# EAGLE schematic MCU (EAGLE 9.6.0)

## Sheet 1 of 2: MCU
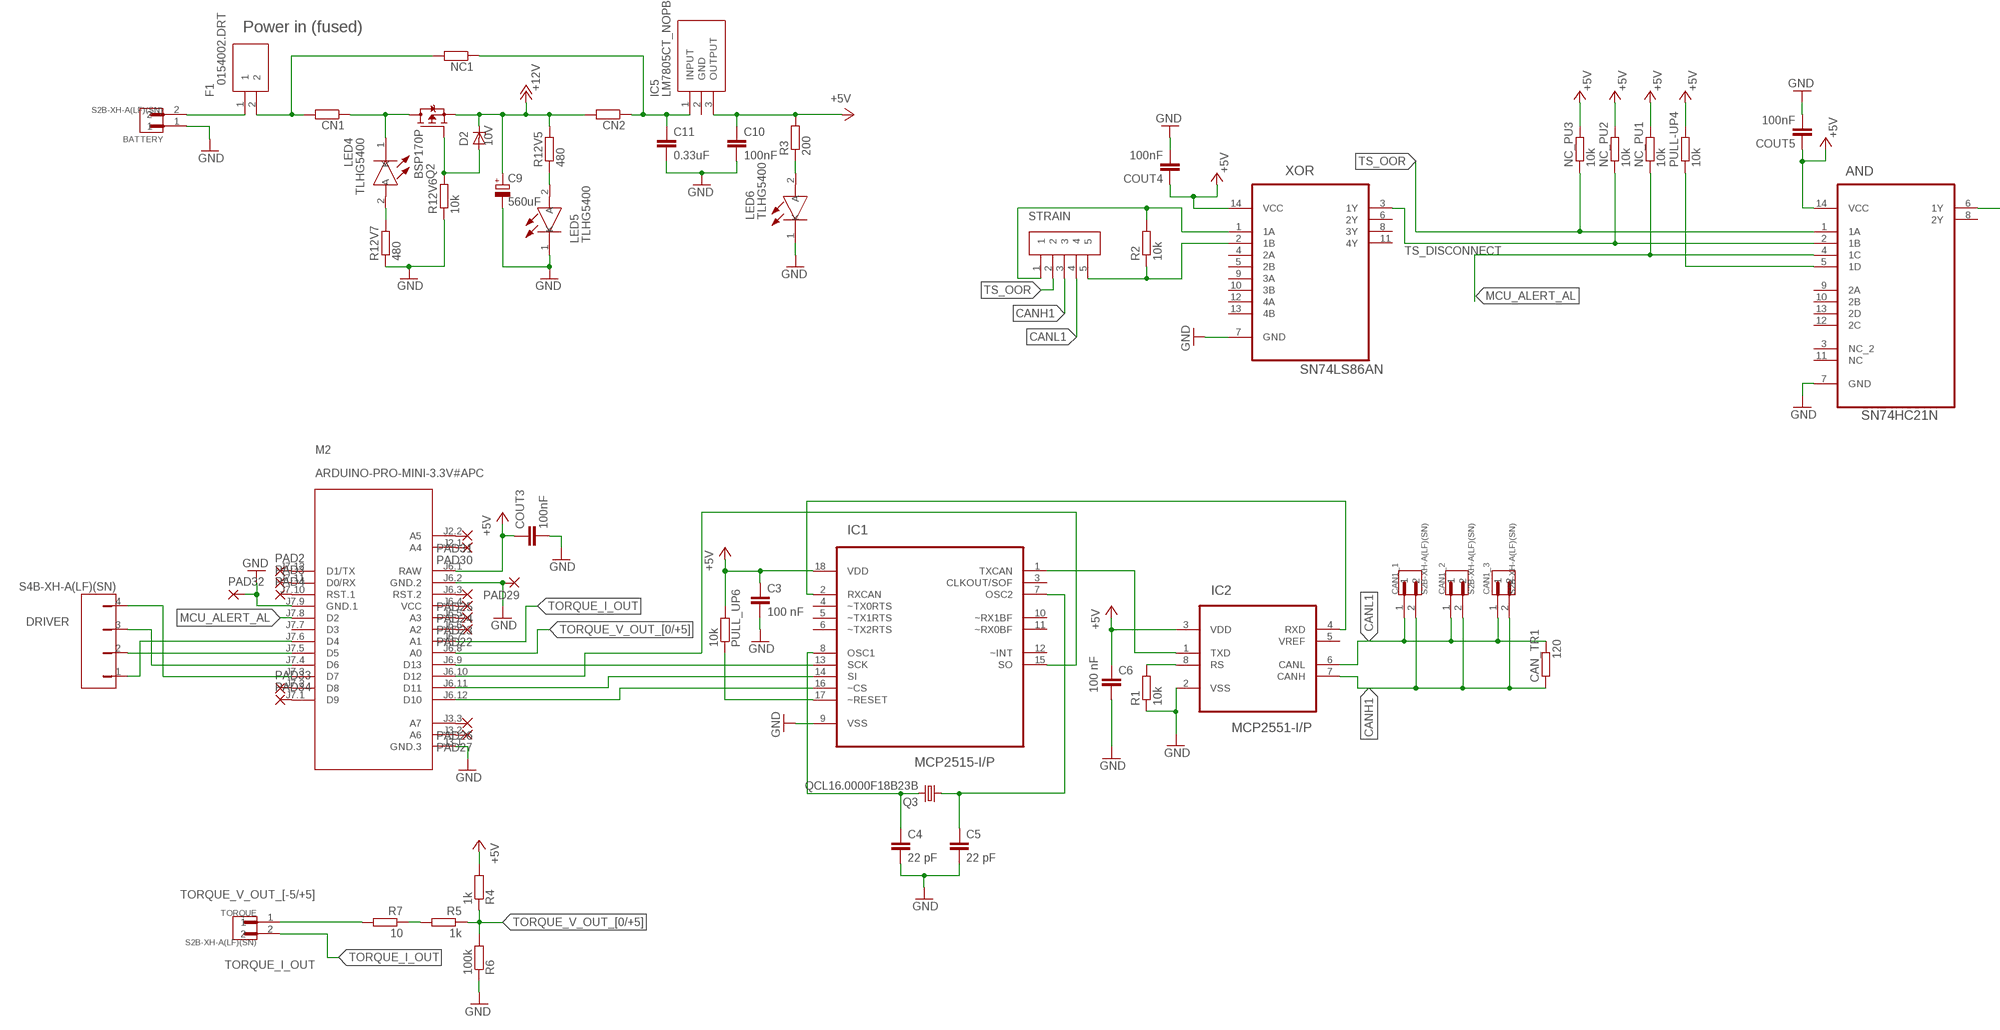
[diagram p0: schematic, sheet 1, part 1 of 2]
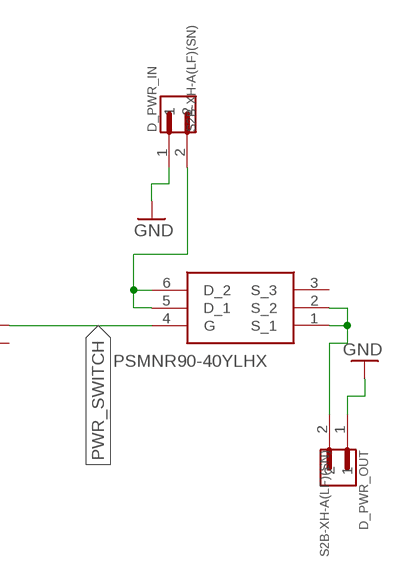
[diagram p1: schematic, sheet 1, part 2 of 2]

### Parts
AND  SN74HC21N  [DIP254P762X508-14]
BATTERY  S2B-XH-A(LF)(SN)  [JST_S2B-XH-A(LF)(SN)]
C3  100 nF  C-EUC0805  [C0805]
C4  22 pF  C-EUC0805  [C0805]
C5  22 pF  C-EUC0805  [C0805]
C6  100 nF  C-EUC0805  [C0805]
C9  560uF  CPOL-EUF  [PANASONIC_F]
C10  100nF  C-EUC0805  [C0805]
C11  0.33uF  C-EUC0805  [C0805]
CAN1_1  S2B-XH-A(LF)(SN)  [JST_S2B-XH-A(LF)(SN)]
CAN1_2  S2B-XH-A(LF)(SN)  [JST_S2B-XH-A(LF)(SN)]
CAN1_3  S2B-XH-A(LF)(SN)  [JST_S2B-XH-A(LF)(SN)]
CAN_TR1  120  R-EU_R0805  [R0805]
CN1  10k  R-EU_R0805  [R0805]
CN2  10k  R-EU_R0805  [R0805]
COUT3  100nF  C-EUC0805  [C0805]
COUT4  100nF  C-EUC0805  [C0805]
COUT5  100nF  C-EUC0805  [C0805]
D2  10V  ZENER-DIODESMB  [SMB]
D_PWR_IN  S2B-XH-A(LF)(SN)  [JST_S2B-XH-A(LF)(SN)]
D_PWR_OUT  S2B-XH-A(LF)(SN)  [JST_S2B-XH-A(LF)(SN)]
DRIVER  S4B-XH-A(LF)(SN)  [S4B-XH-A(LF)(SN)]
F1  0154002.DRT  [FUSM9750X381N]
IC1  MCP2515-I/P  [DIP254P762X432-18]
IC2  MCP2551-I/P  [DIP254P762X432-8]
IC5  LM7805CT_NOPB  [TO254P470X1028X1955-3P]
LED4  TLHG5400  [TLHG5400]
LED5  TLHG5400  [TLHG5400]
LED6  TLHG5400  [TLHG5400]
M2  ARDUINO-PRO-MINI-3.3V#APC  [ARDUINO-PRO-MINI#APC]
NC1  10k  R-EU_R0805  [R0805]
NC_PU1  10k  R-EU_R0805  [R0805]
NC_PU2  10k  R-EU_R0805  [R0805]
NC_PU3  10k  R-EU_R0805  [R0805]
PAD2  SMD2  [SMD1,27-2,54]
PAD3  SMD2  [SMD1,27-2,54]
PAD4  SMD2  [SMD1,27-2,54]
PAD22  SMD2  [SMD1,27-2,54]
PAD23  SMD2  [SMD1,27-2,54]
PAD24  SMD2  [SMD1,27-2,54]
PAD25  SMD2  [SMD1,27-2,54]
PAD26  SMD2  [SMD1,27-2,54]
PAD27  SMD2  [SMD1,27-2,54]
PAD29  SMD2  [SMD1,27-2,54]
PAD30  SMD2  [SMD1,27-2,54]
PAD31  SMD2  [SMD1,27-2,54]
PAD32  SMD2  [SMD1,27-2,54]
PAD33  SMD2  [SMD1,27-2,54]
PAD34  SMD2  [SMD1,27-2,54]
PULL-UP4  10k  R-EU_R0805  [R0805]
PULL_UP6  10k  R-EU_R0805  [R0805]
Q1  PSMNR90-40YLHX  [PSMNR9040YLHX]
Q2  BSP170P  [SOT223]
Q3  QCL16.0000F18B23B  CRYSTALHC49S  [HC49/S]
R1  10k  R-EU_R0805  [R0805]
R2  10k  R-EU_R0805  [R0805]
R3  200  R-EU_R0805  [R0805]
R4  1k  R-EU_R0805  [R0805]
R5  1k  R-EU_R0805  [R0805]
R6  100k  R-EU_R0805  [R0805]
R7  10  R-EU_R0805  [R0805]
R12V5  480  R-EU_R0805  [R0805]
R12V6  10k  R-EU_R0805  [R0805]
R12V7  480  R-EU_R0805  [R0805]
STRAIN  S5B-XH-A(LF)(SN)  [JST_S5B-XH-A(LF)(SN)]
TORQUE  S2B-XH-A(LF)(SN)  [JST_S2B-XH-A(LF)(SN)]
XOR  SN74LS86AN  [DIP254P762X508-14]

### Nets
+5V: AND.14(VCC) C3.1 C6.1 C10.1 COUT3.1 COUT4.1 COUT5.1 IC1.18(VDD) IC2.3(VDD) IC5.3(OUTPUT) M2.J6.1(RAW) NC_PU1.2 NC_PU2.2 NC_PU3.2 PULL-UP4.2 PULL_UP6.2 R3.2 R4.2 XOR.14(VCC) ; also sheet 2
+12V: C9.+ CN2.2 D2.C Q2.3(S) R12V5.2
CANH1: CAN1_1.2 CAN1_2.2 CAN1_3.2 CAN_TR1.1 IC2.7(CANH) STRAIN.3
CANL1: CAN1_1.1 CAN1_2.1 CAN1_3.1 CAN_TR1.2 IC2.6(CANL) STRAIN.4
DRAIN [Driver Power]: D_PWR_IN.2 Q1.5(D_1) Q1.6(D_2)
DRIVER_ALERT_AL: AND.5(1D) PULL-UP4.1
GND: AND.7(GND) BATTERY.1 C3.2 C4.2 C5.2 C6.2 C9.- C10.2 C11.2 COUT3.2 COUT4.2 COUT5.2 D_PWR_IN.1 D_PWR_OUT.1 IC1.9(VSS) IC2.2(VSS) LED5.1(K) LED6.1(K) M2.J3.1(GND.3) M2.J6.2(GND.2) M2.J7.9(GND.1) PAD29.1(P) PAD32.1(P) R1.1 R6.1 R12V6.1 R12V7.1 XOR.7(GND) ; also sheet 2
MCU_ALERT_AL: AND.4(1C) M2.J7.8(D2) NC_PU1.1
N$1: LED4.2(A) R12V7.2
N$2: DRIVER.4 M2.J7.3(D7)
N$3: M2.J7.12(D1/TX) PAD2.1(P)
N$4: M2.J7.11(D0/RX) PAD3.1(P)
N$5: D2.A Q2.1(G) R12V6.2
N$6: BATTERY.2 F1.1
N$7: CN1.1 LED4.1(K) Q2.2(D) Q2.4(D)
N$8: M2.J7.10(RST.1) PAD4.1(P)
N$9: DRIVER.1 M2.J7.6(D4)
N$10: M2.J6.6(A2) PAD22.1(P)
N$11: M2.J6.5(A3) PAD23.1(P)
N$12: M2.J6.4(VCC) PAD24.1(P)
N$13: IC1.15(SO) M2.J6.10(D12)
N$14: M2.J6.3(RST.2) PAD25.1(P)
N$15: DRIVER.2 M2.J7.5(D5)
N$16: R5.2 R7.1
N$17: M2.J3.3(A7) PAD26.1(P)
N$18: LED5.2(A) R12V5.1
N$19: LED6.2(A) R3.1
N$20: IC1.13(SCK) M2.J6.9(D13)
N$21: IC1.14(SI) M2.J6.11(D11)
N$22: IC1.16(~CS) M2.J6.12(D10)
N$23: DRIVER.3 M2.J7.4(D6)
N$24: CN1.2 F1.2 NC1.2
N$25: C11.1 CN2.1 IC5.1(INPUT) NC1.1
N$40: M2.J3.2(A6) PAD27.1(P)
N$42: M2.J2.1(A4) PAD30.1(P)
N$49: M2.J2.2(A5) PAD31.1(P)
N$54: M2.J7.2(D8) PAD33.1(P)
N$55: M2.J7.1(D9) PAD34.1(P)
N$56: IC1.17(~RESET) PULL_UP6.1
N$58: C4.1 IC1.8(OSC1) Q3.2
N$59: C5.1 IC1.7(OSC2) Q3.1
N$60: IC2.8(RS) R1.2
N$62: IC1.2(RXCAN) IC2.4(RXD)
N$63: R2.2 STRAIN.1 XOR.1(1A)
N$67: R2.1 STRAIN.5 XOR.2(1B)
N$68: IC1.1(TXCAN) IC2.1(TXD)
PWR_SWITCH: AND.6(1Y) Q1.4(G)
SOURCE [Driver Power]: D_PWR_OUT.2 Q1.1(S_1) Q1.2(S_2)
TORQUE_I_OUT: M2.J6.7(A1) TORQUE.2
TORQUE_V_OUT_[0/+5]: M2.J6.8(A0) R4.1 R5.1 R6.2
TORQUE_V_OUT_[-5/+5]: R7.2 TORQUE.1
TS_DISCONNECT: AND.2(1B) NC_PU2.1 XOR.3(1Y)
TS_OOR: AND.1(1A) NC_PU3.1 STRAIN.2
Unconnected: AND.3(NC_2) AND.8(2Y) AND.9(2A) AND.10(2B) AND.11(NC) AND.12(2C) AND.13(2D) IC1.3(CLKOUT/SOF) IC1.4(~TX0RTS) IC1.5(~TX1RTS) IC1.6(~TX2RTS) IC1.10(~RX1BF) IC1.11(~RX0BF) IC1.12(~INT) IC2.5(VREF) IC5.2(GND) M2.J7.7(D3) Q1.3(S_3) XOR.4(2A) XOR.5(2B) XOR.6(2Y) XOR.8(3Y) XOR.9(3A) XOR.10(3B) XOR.11(4Y) XOR.12(4A) XOR.13(4B)

### Notes on the sheet
- Power in (fused)

## Sheet 2 of 2: STRAIN GAUGE
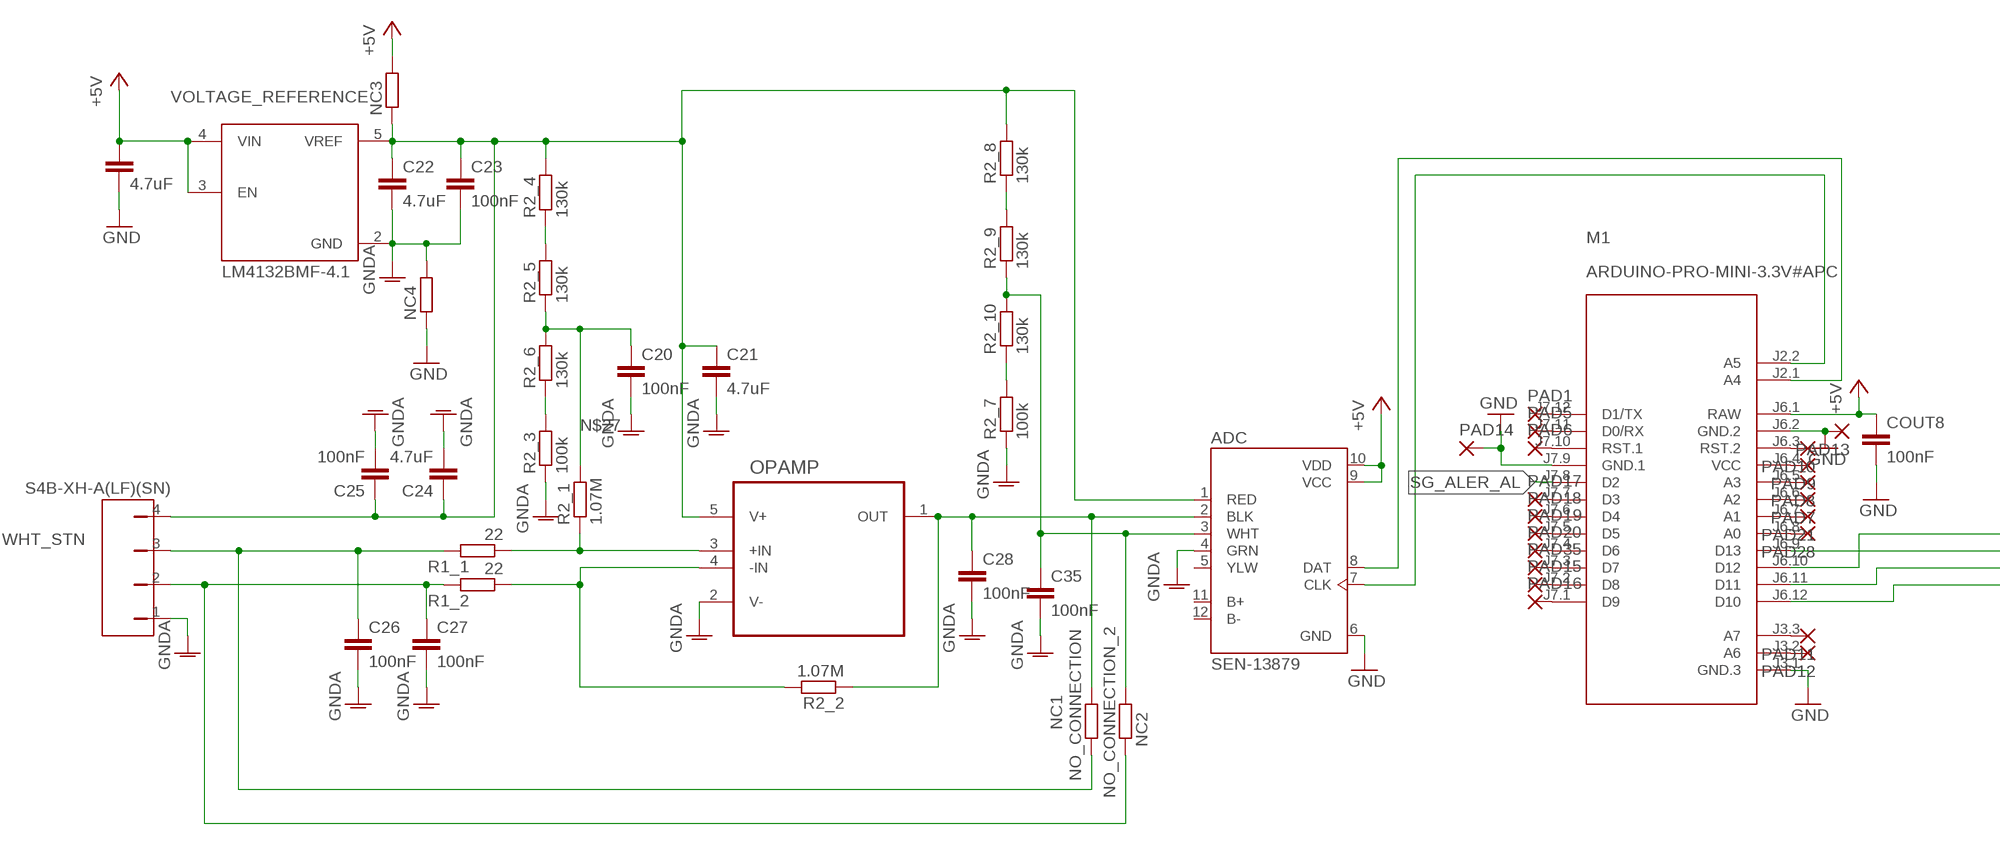
[diagram p2: schematic, sheet 2, part 1 of 2]
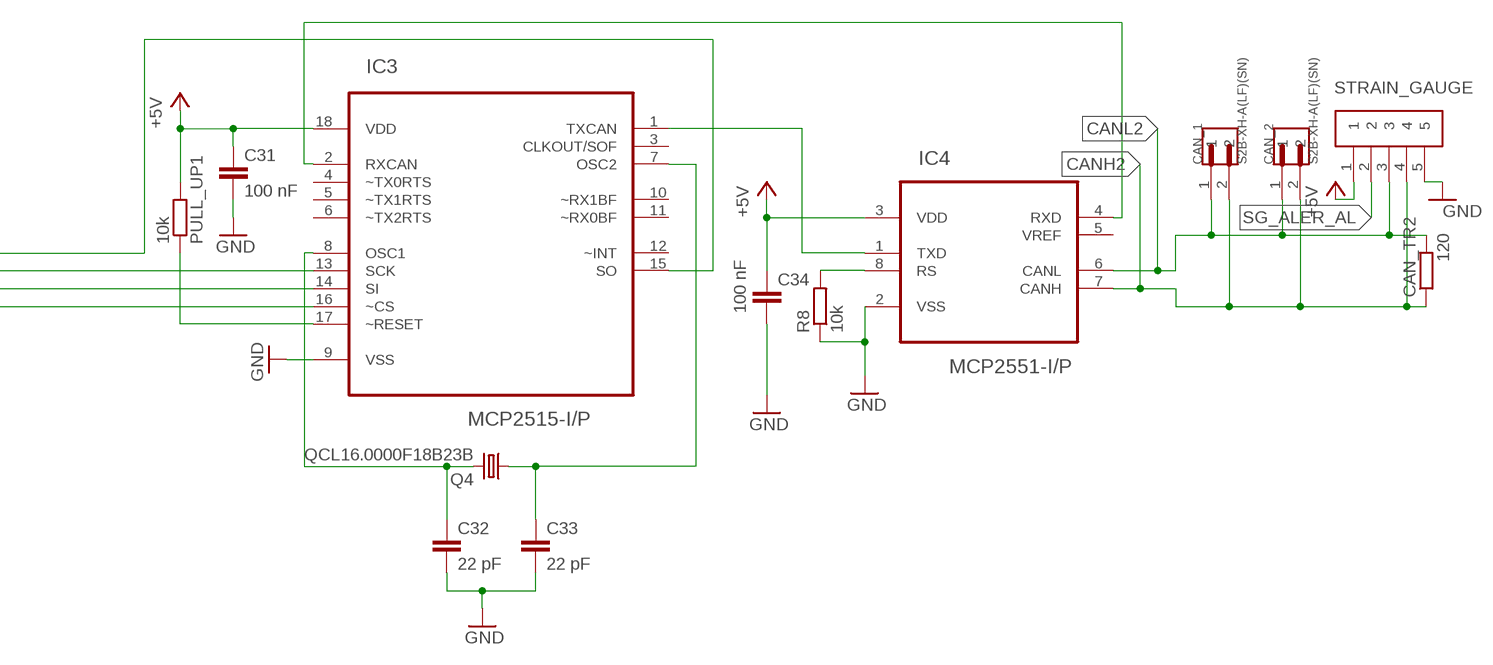
[diagram p3: schematic, sheet 2, part 2 of 2]

### Parts
ADC  SEN-13879  [SPARKFUN_SEN-13879]
C19  4.7uF  C-EUC0805  [C0805]
C20  100nF  C-EUC0805  [C0805]
C21  4.7uF  C-EUC0805  [C0805]
C22  4.7uF  C-EUC0805  [C0805]
C23  100nF  C-EUC0805  [C0805]
C24  4.7uF  C-EUC0805  [C0805]
C25  100nF  C-EUC0805  [C0805]
C26  100nF  C-EUC0805  [C0805]
C27  100nF  C-EUC0805  [C0805]
C28  100nF  C-EUC0805  [C0805]
C31  100 nF  C-EUC0805  [C0805]
C32  22 pF  C-EUC0805  [C0805]
C33  22 pF  C-EUC0805  [C0805]
C34  100 nF  C-EUC0805  [C0805]
C35  100nF  C-EUC0805  [C0805]
CAN_1  S2B-XH-A(LF)(SN)  [JST_S2B-XH-A(LF)(SN)]
CAN_2  S2B-XH-A(LF)(SN)  [JST_S2B-XH-A(LF)(SN)]
CAN_TR2  120  R-EU_R0805  [R0805]
COUT8  100nF  C-EUC0805  [C0805]
IC3  MCP2515-I/P  [DIP254P762X432-18]
IC4  MCP2551-I/P  [DIP254P762X432-8]
M1  ARDUINO-PRO-MINI-3.3V#APC  [ARDUINO-PRO-MINI#APC]
NC3  R-EU_R0805  [R0805]
NC4  R-EU_R0805  [R0805]
NO_CONNECTION  NC1  R-EU_R0805  [R0805]
NO_CONNECTION_2  NC2  R-EU_R0805  [R0805]
OPAMP  LMP7731MF  [SOT95P284X119-5N]
PAD1  SMD2  [SMD1,27-2,54]
PAD5  SMD2  [SMD1,27-2,54]
PAD6  SMD2  [SMD1,27-2,54]
PAD7  SMD2  [SMD1,27-2,54]
PAD8  SMD2  [SMD1,27-2,54]
PAD9  SMD2  [SMD1,27-2,54]
PAD10  SMD2  [SMD1,27-2,54]
PAD11  SMD2  [SMD1,27-2,54]
PAD12  SMD2  [SMD1,27-2,54]
PAD13  SMD2  [SMD1,27-2,54]
PAD14  SMD2  [SMD1,27-2,54]
PAD15  SMD2  [SMD1,27-2,54]
PAD16  SMD2  [SMD1,27-2,54]
PAD17  SMD2  [SMD1,27-2,54]
PAD18  SMD2  [SMD1,27-2,54]
PAD19  SMD2  [SMD1,27-2,54]
PAD20  SMD2  [SMD1,27-2,54]
PAD21  SMD2  [SMD1,27-2,54]
PAD28  SMD2  [SMD1,27-2,54]
PAD35  SMD2  [SMD1,27-2,54]
PULL_UP1  10k  R-EU_R0805  [R0805]
Q4  QCL16.0000F18B23B  CRYSTALHC49S  [HC49/S]
R1_1  22  R-EU_R0805  [R0805]
R1_2  22  R-EU_R0805  [R0805]
R2_1  1.07M  R-EU_R0805  [R0805]
R2_2  1.07M  R-EU_R0805  [R0805]
R2_3  100k  R-EU_R0805  [R0805]
R2_4  130k  R-EU_R0805  [R0805]
R2_5  130k  R-EU_R0805  [R0805]
R2_6  130k  R-EU_R0805  [R0805]
R2_7  100k  R-EU_R0805  [R0805]
R2_8  130k  R-EU_R0805  [R0805]
R2_9  130k  R-EU_R0805  [R0805]
R2_10  130k  R-EU_R0805  [R0805]
R8  10k  R-EU_R0805  [R0805]
STRAIN_GAUGE  S5B-XH-A(LF)(SN)  [JST_S5B-XH-A(LF)(SN)]
VOLTAGE_REFERENCE  LM4132BMF-4.1  [SOT95P280X145-5N]
WHT_STN  S4B-XH-A(LF)(SN)  [S4B-XH-A(LF)(SN)]

### Nets
+5V: ADC.9(VCC) ADC.10(VDD) C19.1 C31.1 C34.1 COUT8.1 IC3.18(VDD) IC4.3(VDD) M1.J6.1(RAW) NC3.2 PULL_UP1.2 STRAIN_GAUGE.1 VOLTAGE_REFERENCE.3(EN) VOLTAGE_REFERENCE.4(VIN) ; also sheet 1
CANH2: CAN_1.2 CAN_2.2 CAN_TR2.1 IC4.7(CANH) STRAIN_GAUGE.4
CANL2: CAN_1.1 CAN_2.1 CAN_TR2.2 IC4.6(CANL) STRAIN_GAUGE.3
GND: ADC.6(GND) C19.2 C31.2 C32.2 C33.2 C34.2 COUT8.2 IC3.9(VSS) IC4.2(VSS) M1.J3.1(GND.3) M1.J6.2(GND.2) M1.J7.9(GND.1) NC4.1 PAD13.1(P) PAD14.1(P) R8.1 STRAIN_GAUGE.5 ; also sheet 1
GNDA: ADC.4(GRN) C20.2 C21.2 C22.2 C23.2 C24.2 C25.2 C26.2 C27.2 C28.2 C35.2 NC4.2 OPAMP.2(V-) R2_3.1 R2_7.1 VOLTAGE_REFERENCE.2(GND) WHT_STN.1
N$27: C20.1 R2_1.2 R2_5.1 R2_6.2
N$28: ADC.2(BLK) C28.1 NO_CONNECTION.2 OPAMP.1(OUT) R2_2.1
N$29: OPAMP.4(-IN) R1_2.1 R2_2.2
N$30: OPAMP.3(+IN) R1_1.1 R2_1.1
N$31: R2_3.2 R2_6.1
N$32: M1.J7.12(D1/TX) PAD1.1(P)
N$33: M1.J7.11(D0/RX) PAD5.1(P)
N$34: M1.J7.10(RST.1) PAD6.1(P)
N$35: R2_4.1 R2_5.2
N$36: M1.J6.7(A1) PAD21.1(P)
N$37: M1.J6.6(A2) PAD7.1(P)
N$38: M1.J6.5(A3) PAD8.1(P)
N$39: M1.J6.4(VCC) PAD9.1(P)
N$41: M1.J6.3(RST.2) PAD10.1(P)
N$43: M1.J3.3(A7) PAD11.1(P)
N$44: M1.J3.2(A6) PAD12.1(P)
N$45: M1.J6.8(A0) PAD28.1(P)
N$46: M1.J7.2(D8) PAD15.1(P)
N$47: M1.J7.1(D9) PAD16.1(P)
N$48: IC3.17(~RESET) PULL_UP1.1
N$50: C32.1 IC3.8(OSC1) Q4.2
N$51: C33.1 IC3.7(OSC2) Q4.1
N$52: IC4.8(RS) R8.2
N$53: IC3.2(RXCAN) IC4.4(RXD)
N$57: IC3.1(TXCAN) IC4.1(TXD)
N$61: IC3.15(SO) M1.J6.10(D12)
N$65: IC3.13(SCK) M1.J6.9(D13)
N$66: IC3.14(SI) M1.J6.11(D11)
N$69: IC3.16(~CS) M1.J6.12(D10)
N$70: ADC.7(CLK) M1.J2.2(A5)
N$71: ADC.8(DAT) M1.J2.1(A4)
N$72: R2_8.1 R2_9.2
N$73: R2_7.2 R2_10.1
N$74: M1.J7.7(D3) PAD17.1(P)
N$75: M1.J7.6(D4) PAD18.1(P)
N$76: M1.J7.5(D5) PAD19.1(P)
N$77: M1.J7.4(D6) PAD20.1(P)
N$78: M1.J7.3(D7) PAD35.1(P)
N$79: C27.1 NO_CONNECTION_2.1 R1_2.2 WHT_STN.2
N$82: ADC.3(WHT) C35.1 NO_CONNECTION_2.2 R2_9.1 R2_10.2
N$83: ADC.1(RED) C21.1 C22.1 C23.1 C24.1 C25.1 NC3.1 OPAMP.5(V+) R2_4.2 R2_8.2 VOLTAGE_REFERENCE.5(VREF) WHT_STN.4
SG_ALER_AL: M1.J7.8(D2) STRAIN_GAUGE.2
VCCINT4: C26.1 NO_CONNECTION.1 R1_1.2 WHT_STN.3
Unconnected: ADC.5(YLW) ADC.11(B+) ADC.12(B-) IC3.3(CLKOUT/SOF) IC3.4(~TX0RTS) IC3.5(~TX1RTS) IC3.6(~TX2RTS) IC3.10(~RX1BF) IC3.11(~RX0BF) IC3.12(~INT) IC4.5(VREF)

## Library data of the parts
ADC = SEN-13879:SEN-13879: Load Cell Amp Hx711; DESCRIPTION: External Input Sensor Amplifier; DIGI-KEY_PART_NUMBER: 1568-1436-ND; DIGI-KEY_PURCHASE_URL: https://www.digikey.com/product-detail/en/sparkfun-electronics/SEN-13879/1568-1436-ND/6202732?utm_source=snapeda&utm_medium=aggregator&utm_campaign=symbol; MF: SparkFun; MP: SEN-13879; PACKAGE: None
AND = SN74HC21N:SN74HC21N: DUAL 4-IN POS AND GATES; AVAILABILITY: Unavailable; DESCRIPTION: AND Gate IC 2 Channel 14-PDIP; MF: Texas Instruments; MP: SN74HC21N; PACKAGE: DIP-14 Texas Instruments; PRICE: None
BATTERY CAN1_1-CAN1_3 CAN_1 CAN_2 D_PWR_IN D_PWR_OUT TORQUE = S2B-XH-A_LF__SN_:S2B-XH-A(LF)(SN): XH Series 2.5mm 2 Position Through Hole Shrouded Header Connector; DESCRIPTION: Connector Header Through Hole, Right Angle 2 position 0.098 _2.50mm_; DIGI-KEY_PART_NUMBER: 455-2257-ND; DIGI-KEY_PURCHASE_URL: https://www.digikey.com/product-detail/en/jst-sales-america-inc/S2B-XH-A_LF__SN_/455-2257-ND/1651055?utm_source=snapeda&utm_medium=aggregator&utm_campaign=symbol; MF: JST Sales; MP: S2B-XH-A_LF__SN_; PACKAGE: None
C3-C6 C10 C11 C19-C28 C31-C35 COUT3-COUT5 COUT8 = rcl:C-EU: CAPACITOR, European symbol; SPICEPREFIX: C
C9 = rcl:CPOL-EU: POLARIZED CAPACITOR, European symbol; SPICEPREFIX: C
CAN_TR1 CAN_TR2 CN1 CN2 NC1 NC3 NC4 NC_PU1-NC_PU3 NO_CONNECTION NO_CONNECTION_2 PULL-UP4 PULL_UP1 PULL_UP6 R1 R1_1 R1_2 R2 R2_1-R2_10 R3-R8 R12V5-R12V7 = rcl:R-EU_: RESISTOR, European symbol; SPICEPREFIX: R
D2 = diode:ZENER-DIODE: Z-Diode
DRIVER WHT_STN = S4B-XH-A_LF__SN_:S4B-XH-A(LF)(SN): http://octopart.com/s4b-xh-a%28lf%29%28sn%29-jst-7995347; AVAILABILITY: Unavailable; DESCRIPTION: Connector Header Through Hole, Right Angle 4 position 0.098 _2.50mm_; MF: JST Sales; MP: S4B-XH-A_LF__SN_; PACKAGE: None; PRICE: None
F1 = 0154002.DRT:0154002.DRT: Littelfuse 2A T Surface Mount Fuse, 125V ac/dc Source: Datasheet; DESCRIPTION: Littelfuse 2A T Surface Mount Fuse, 125V ac/dc; HEIGHT: 3.81mm; MANUFACTURER_NAME: LITTELFUSE; MANUFACTURER_PART_NUMBER: 0154002.DRT; MOUSER_PART_NUMBER: 576-0154002.DRT; MOUSER_PRICE-STOCK: https://www.mouser.co.uk/ProductDetail/Littelfuse/0154002DRT?qs=2VFNtWizgicDQ8R7JxIsmA%3D%3D
IC1 IC3 = MCP2515-I_P:MCP2515-I/P: Stand-Alone CAN Controller; AVAILABILITY: Unavailable; DESCRIPTION: MCP2515 Series 5.5 V 1 Mb/s Stand Alone SPI Interface CAN Controller - PDIP-18; MF: Microchip; MP: MCP2515-I/P; PACKAGE: DIP-18 Microchip; PRICE: None
IC2 IC4 = MCP2551-I_P:MCP2551-I/P: High-Speed CAN Transceiver; AVAILABILITY: Unavailable; DESCRIPTION: MCP2551 Series 5.5 V 1 Mb/s Surface Mount High-Speed CAN Transceiver - PDIP-8; MF: Microchip; MP: MCP2551-I/P; PACKAGE: DIP-8 Microchip; PRICE: None
IC5 = LM7805CT_NOPB:LM7805CT_NOPB: 1.5-A, Wide VIN Fixed Voltage Regulators Source: Datasheet <http://www.ti.com/lit/gpn/lm7800>; DESCRIPTION: 1.5-A, Wide VIN Fixed Voltage Regulators; HEIGHT: 4.7mm; MANUFACTURER_NAME: Texas Instruments; MANUFACTURER_PART_NUMBER: LM7805CT/NOPB; MOUSER_PART_NUMBER: 926-LM7805CT/NOPB; MOUSER_PRICE-STOCK: https://www.mouser.co.uk/ProductDetail/Texas-Instruments/LM7805CT-NOPB?qs=OYMYEaN9QmBS2GvaX6GSkQ%3D%3D
LED4-LED6 = TLHG5400:TLHG5400: Vishay TLHG5400, 575 nm Green LED, 5mm (T-1 3/4) Round Through Hole package Source: Datasheet <https://componentsearchengine.com/Datasheets/1/TLHG5400.pdf>; DESCRIPTION: Vishay TLHG5400, 575 nm Green LED, 5mm (T-1 3/4) Round Through Hole package; HEIGHT: 9mm; MANUFACTURER_NAME: Vishay; MANUFACTURER_PART_NUMBER: TLHG5400; MOUSER_PART_NUMBER: 78-TLHG5400; MOUSER_PRICE-STOCK: https://www.mouser.com/Search/Refine.aspx?Keyword=78-TLHG5400
M1 M2 = diy-modules:ARDUINO-PRO-MINI-*#APC: Arduino Pro Mini (and compatible devices) with angle programming connector More details available here: https://www.arduino.cc/en/Main/ArduinoBoardProMini Click here to find device on ebay.com <http://www.ebay.com/sch/arduino+pro+mini>
OPAMP = LMP7731MF:LMP7731MF: Amplifier; AVAILABILITY: Unavailable; DESCRIPTION: Ic Amp Prec Rrio Ln Sgl Sot23-5 - Lmp7731mf/Nopb; MF: Texas Instruments; MP: LMP7731MF; PACKAGE: SOT-23 Texas Instruments; PRICE: None
PAD1-PAD35 = wirepad:SMD2: SMD PAD
Q1 = PSMNR90-40YLHX:PSMNR90-40YLHX: MOSFET N-CH 40 V LOGIC LEVEL Source: Datasheet <https://componentsearchengine.com/Datasheets/1/PSMNR90-40YLHX.pdf>; DESCRIPTION: MOSFET N-CH 40 V LOGIC LEVEL; HEIGHT: 1.1mm; MANUFACTURER_NAME: Nexperia; MANUFACTURER_PART_NUMBER: PSMNR90-40YLHX; MOUSER_PART_NUMBER: 771-PSMNR90-40YLHX; MOUSER_PRICE-STOCK: https://www.mouser.com/Search/Refine.aspx?Keyword=771-PSMNR90-40YLHX
Q2 = transistor-fet:BSP170P: SIPMOS(R) Small-Signal-Transistor P-Channel, Enhancement mode Source: http://www.infineon.com/upload/Document/BSP170P_Rev2.4.pdf
Q3 Q4 = adafruit:CRYSTAL: CRYSTAL; OC_FARNELL: 1667008; OC_NEWARK: unknown
STRAIN STRAIN_GAUGE = S5B-XH-A_LF__SN_:S5B-XH-A(LF)(SN): XH Connector 2.5mm pitch/Disconnectable Crimp Style Connector; AVAILABILITY: Unavailable; DESCRIPTION: Connector Header Through Hole, Right Angle 5 position 0.098 _2.50mm_; MF: JST Sales; MP: S5B-XH-A_LF__SN_; PACKAGE: None; PRICE: None
VOLTAGE_REFERENCE = LM4132BMF-4.1:LM4132BMF-4.1: Voltage Reference, Precision, Low Dropout, Series - Fixed, LM4132 Series, 4.096V, SOT-23-5; AVAILABILITY: Unavailable; DESCRIPTION: Series Voltage Reference IC ±0.1% SOT-23-5; MF: Texas Instruments; MP: LM4132BMF-4.1; PACKAGE: SOT-23 Texas Instruments; PRICE: None
XOR = SN74LS86AN:SN74LS86AN: QUADRUPLE 2-INPUT EXCLUSIVE-OR GATES; AVAILABILITY: Unavailable; DESCRIPTION: XOR _Exclusive OR_ IC 4 Channel 14-SOP; MF: Texas Instruments; MP: SN74LS86AN; PACKAGE: DIP-14 Texas Instruments; PRICE: None

## Net classes
1 signal: width 0.3 mm, drill 0.4 mm, clearance 0.25 mm
2 12V: width 1 mm, drill 1.1 mm, clearance 0.25 mm
3 Driver Power: width 2 mm, drill 0.4 mm, clearance 0.5 mm